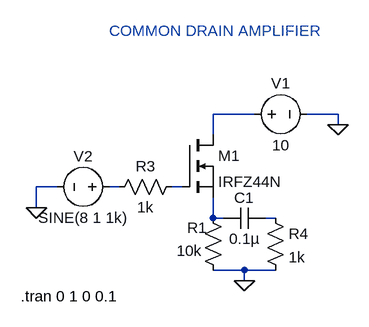
[diagram p0: schematic 13)common_drain_amp.asc]
13)common_drain_amp.asc, the LTspice schematic file:
Version 4
SHEET 1 880 680
WIRE 256 64 192 64
WIRE 384 64 336 64
WIRE 384 80 384 64
WIRE 192 96 192 64
WIRE -48 176 -80 176
WIRE 48 176 32 176
WIRE 144 176 128 176
WIRE -80 208 -80 176
WIRE 192 224 192 192
WIRE 208 224 192 224
WIRE 288 224 272 224
WIRE 240 304 192 304
WIRE 288 304 240 304
WIRE 240 320 240 304
FLAG 240 320 0
FLAG 384 80 0
FLAG -80 208 0
SYMBOL nmos 144 96 R0
SYMATTR InstName M1
SYMATTR Value IRFZ44N
SYMBOL res 176 208 R0
WINDOW 0 -24 31 Left 2
WINDOW 3 -40 66 Left 2
SYMATTR InstName R1
SYMATTR Value 10k
SYMBOL cap 272 208 R90
WINDOW 0 0 32 VBottom 2
WINDOW 3 32 32 VTop 2
SYMATTR InstName C1
SYMATTR Value 0.1µ
SYMBOL voltage 240 64 R270
WINDOW 0 32 56 VTop 2
WINDOW 3 -32 56 VBottom 2
WINDOW 123 0 0 Left 0
WINDOW 39 0 0 Left 0
SYMATTR InstName V1
SYMATTR Value 10
SYMBOL voltage 48 176 R90
WINDOW 0 -32 56 VBottom 2
WINDOW 3 32 56 VTop 2
WINDOW 123 0 0 Left 0
WINDOW 39 0 0 Left 0
SYMATTR InstName V2
SYMATTR Value SINE(8 1 1k)
SYMBOL res 32 192 R270
WINDOW 0 32 56 VTop 2
WINDOW 3 0 56 VBottom 2
SYMATTR InstName R3
SYMATTR Value 1k
SYMBOL res 272 208 R0
SYMATTR InstName R4
SYMATTR Value 1k
TEXT -104 344 Left 2 !.tran 0 1 0 0.1
TEXT 32 -64 Left 2 ;COMMON DRAIN AMPLIFIER

The netlist it stands for:
* 13)common_drain_amp.asc
M1 N001 N003 N004 N004 IRFZ44N
R1 N004 0 10k
C1 N005 N004 0.1µ
V1 N001 0 10
V2 N002 0 SINE(8 1 1k)
R3 N002 N003 1k
R4 N005 0 1k
.model NMOS NMOS
.model PMOS PMOS
.lib standard.mos
.tran 0 1 0 0.1
* COMMON DRAIN AMPLIFIER
.backanno
.end